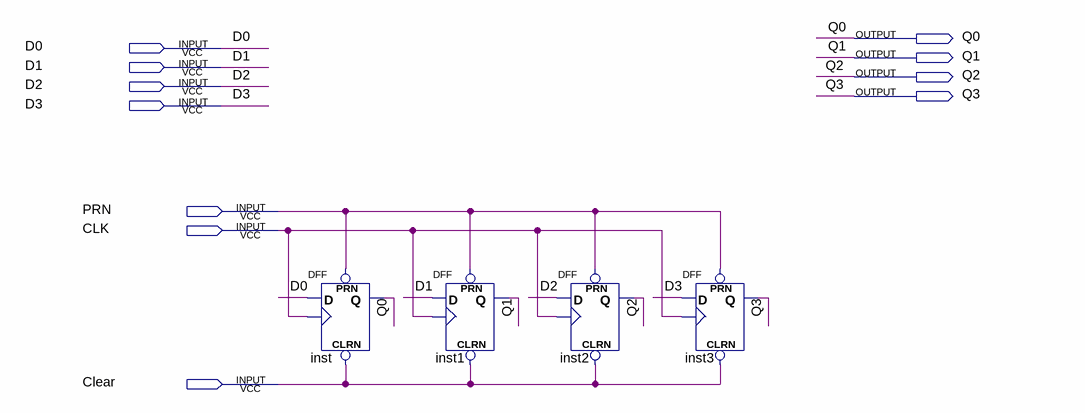
[diagram p0: schematic sheet]
// Quartus schematic 4BitRegister.bdf as structural Verilog: 4 symbols, 11 pins
module \4BitRegister  (
  input  D0,
  input  D1,
  input  D2,
  input  D3,
  input  PRN,
  input  CLK,
  input  Clear,
  output Q0,
  output Q1,
  output Q2,
  output Q3
);

  DFF inst (.CLRN(Clear), .CLK(CLK), .D(D0), .PRN(PRN), .Q(Q0));
  DFF inst1 (.CLRN(Clear), .CLK(CLK), .D(D1), .PRN(PRN), .Q(Q1));
  DFF inst2 (.CLRN(Clear), .CLK(CLK), .D(D2), .PRN(PRN), .Q(Q2));
  DFF inst3 (.CLRN(Clear), .CLK(CLK), .D(D3), .PRN(PRN), .Q(Q3));
endmodule
